# EAGLE design BNC CONECTOR (EAGLE 7.6.0)
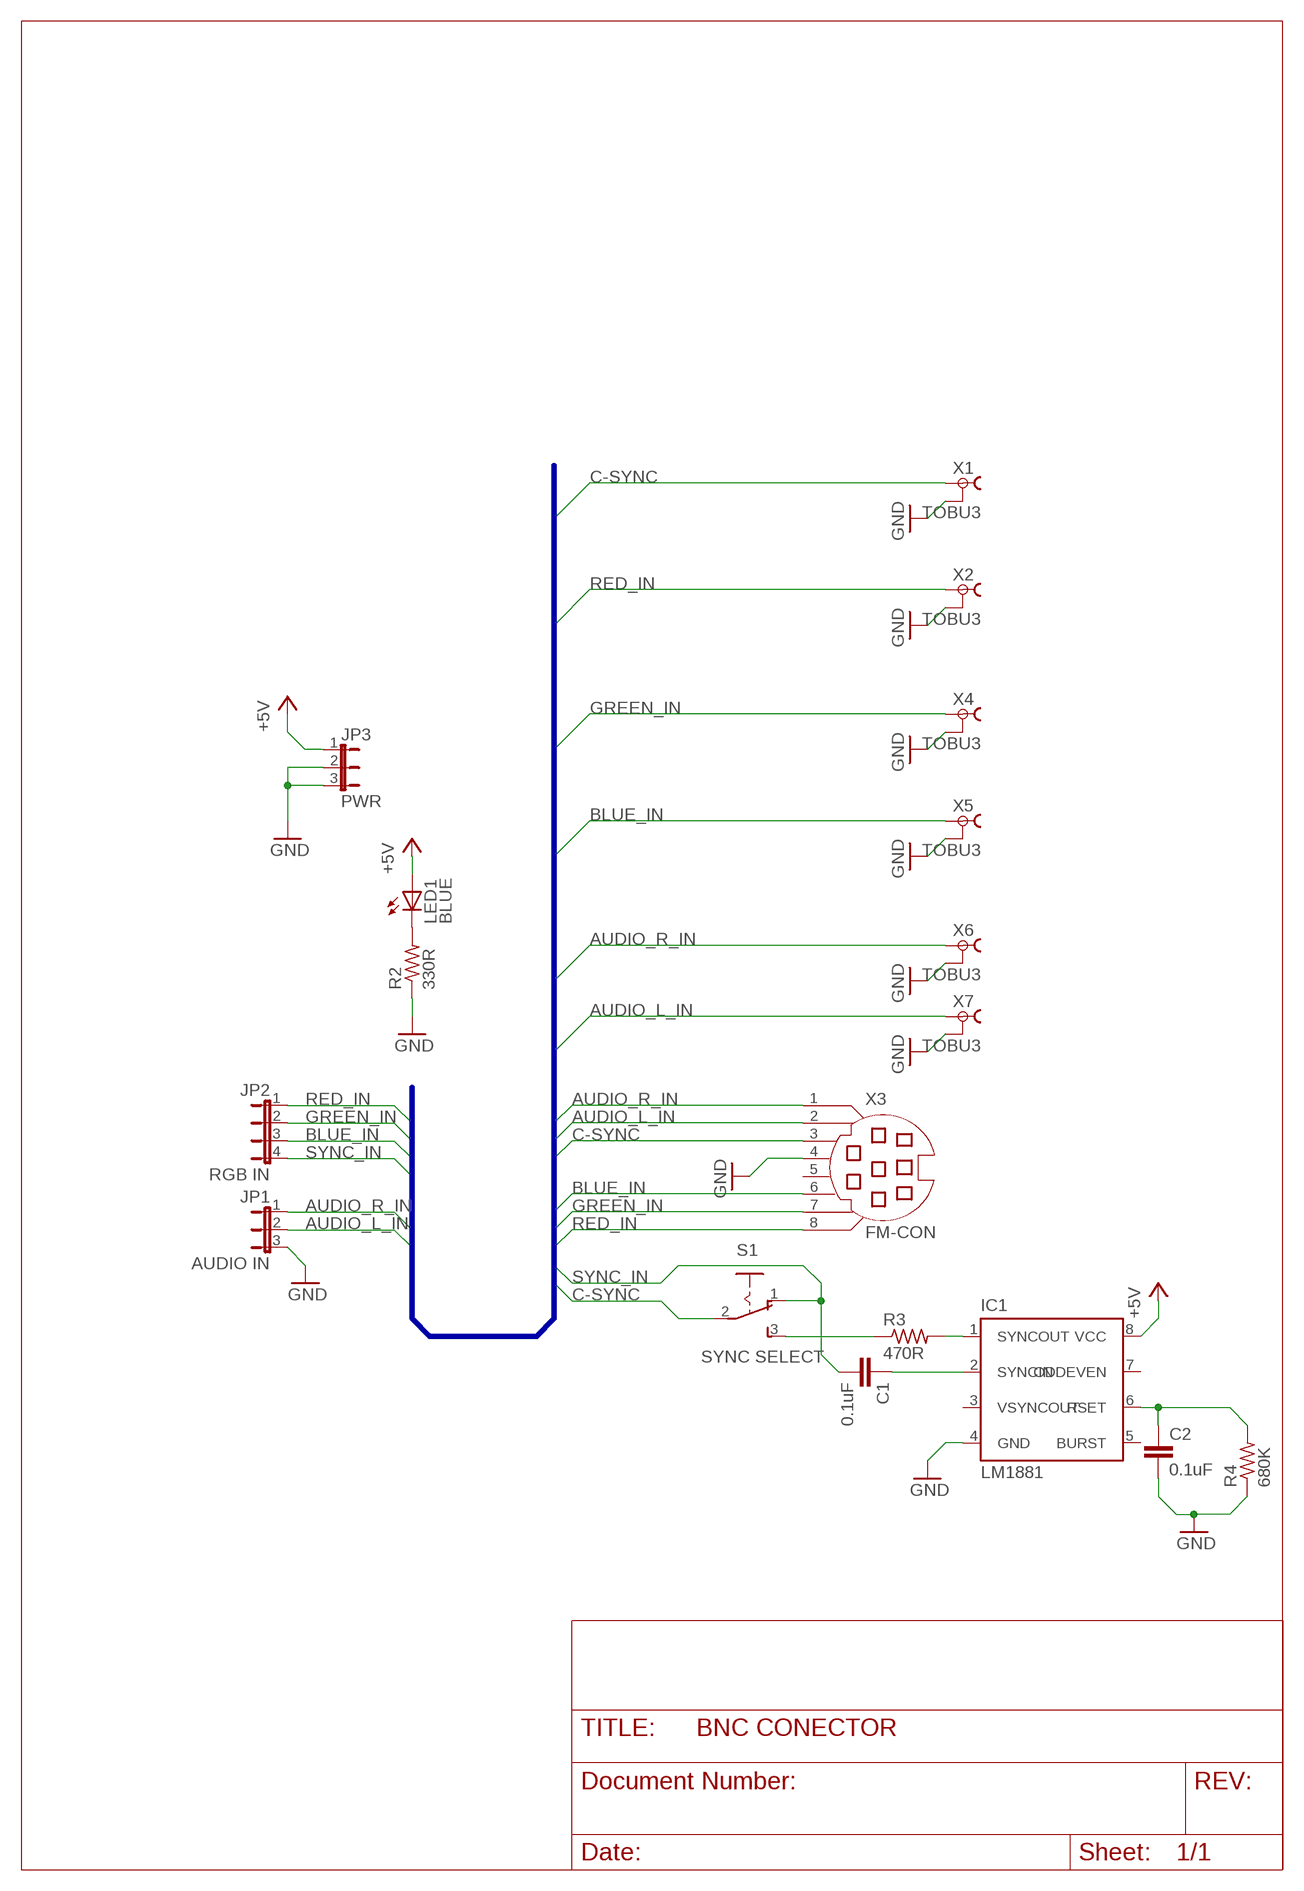
[diagram p0: schematic, sheet 1]

## Parts
C1  0.1uF  C7.5/3  [C7.5B3]
C2  0.1uF  C7.5/3  [C7.5B3]
IC1  LM1881  [DIL08]
JP1  AUDIO IN  JP2E  [JP2]
JP2  RGB IN  JP4E  [JP4]
JP3  PWR  JP2E  [JP2]
LED1  BLUE  LED5MM  [LED5MM]
R2  330R  R-US_0204/7  [0204/7]
R3  470R  R-US_0204/7  [0204/7]
R4  680K  R-US_0204/7  [0204/7]
S1  SYNC SELECT  255SB  [255SB]
X1  TOBU3  [TOBU3]
X2  TOBU3  [TOBU3]
X3  FM-CON  MD08SS  [MDIN08SS]
X4  TOBU3  [TOBU3]
X5  TOBU3  [TOBU3]
X6  TOBU3  [TOBU3]
X7  TOBU3  [TOBU3]

## Nets
+5V [SINGAL]: IC1.8(VCC) JP3.1 LED1.A
AUDIO_L_IN [SINGAL]: JP1.2 X3.2 X7.1
AUDIO_R_IN [SINGAL]: JP1.1 X3.1 X6.1
BLUE_IN [SINGAL]: JP2.3 X3.6 X5.1
C-SYNC [SINGAL]: S1.2(P) X1.1 X3.3
GND [SINGAL]: C2.2 IC1.4(GND) JP1.3 JP3.2 JP3.3 R2.1 R4.1 X1.2 X1.2@1 X1.2@2 X2.2 X2.2@1 X2.2@2 X3.4 X4.2 X4.2@1 X4.2@2 X5.2 X5.2@1 X5.2@2 X6.2 X6.2@1 X6.2@2 X7.2 X7.2@1 X7.2@2
GREEN_IN [SINGAL]: JP2.2 X3.7 X4.1
N$2 [SINGAL]: R3.1 S1.3(S)
N$3 [SINGAL]: IC1.1(SYNCOUT) R3.2
N$4: LED1.K(C) R2.2
N$5 [SINGAL]: C1.1 IC1.2(SYNCIN)
N$6 [SINGAL]: C2.1 IC1.6(RSET) R4.2
RED_IN [SINGAL]: JP2.1 X2.1 X3.8
SYNC_IN [SINGAL]: C1.2 JP2.4 S1.1(O)
Unconnected: IC1.3(VSYNCOUT) IC1.5(BURST) IC1.7(ODDEVEN) X3.5

## Buses
B$1

## Library data of the parts
C1 C2 = capacitor-wima:C: CAPACITOR naming: grid - package width
IC1 = lm1881:LM1881
JP1 JP3 = jumper:JP2E: JUMPER
JP2 = jumper:JP4E: JUMPER
LED1 = led:LED: LED OSRAM: - CHIPLED LG R971, LG N971, LY N971, LG Q971, LY Q971, LO R971, LY R971 LH N974, LH R974 LS Q976, LO Q976, LY Q976 LO Q996 - Hyper CHIPLED LW Q18S LB Q993, LB Q99A, LB R99A - SideLED LS A670, LO A670, LY A670, LG A670, LP A670 LB A673, LV A673, LT A673, LW A673 LH A674 LY A675 LS A676, LA A676, LO A676, LY A676, LW A676 LS A679, LY A679, LG A679 - Hyper Micro SIDELED® LS Y876, LA Y876, LO Y876, LY Y876 LT Y87S - SmartLED LW L88C, LW L88S LB L89C, LB L89S, LG L890 LS L89K, LO L89K, LY L89K LS L896, LA L896, LO L896, LY L896 - TOPLED LS T670, LO T670, LY T670, LG T670, LP T670 LSG T670, LSP T670, LSY T670, LOP T670, LYG T670 LG T671, LOG T671, LSG T671 LB T673, LV T673, LT T673, LW T673 LH T674 LS T676, LA T676, LO T676, LY T676, LB T676, LH T676, LSB T676, LW T676 LB T67C, LV T67C, LT T67C, LS T67K, LO T67K, LY T67K, LW E67C LS E67B, LA E67B, LO E67B, LY E67B, LB E67C, LV E67C, LT E67C LW T67C LS T679, LY T679, LG T679 LS T770, LO T770, LY T770, LG T770, LP T770 LB T773, LV T773, LT T773, LW T773 LH T774 LS E675, LA E675, LY E675, LS T675 LS T776, LA T776, LO T776, LY T776, LB T776 LHGB T686 LT T68C, LB T68C - Hyper Mini TOPLED® LB M676 - Mini TOPLED Santana® LG M470 LS M47K, LO M47K, LY M47K Source: http://www.osram.convergy.de LUXEON: - LUMILED® LXK2-PW12-R00, LXK2-PW12-S00, LXK2-PW14-U00, LXK2-PW14-V00 LXK2-PM12-R00, LXK2-PM12-S00, LXK2-PM14-U00 LXK2-PE12-Q00, LXK2-PE12-R00, LXK2-PE12-S00, LXK2-PE14-T00, LXK2-PE14-U00 LXK2-PB12-K00, LXK2-PB12-L00, LXK2-PB12-M00, LXK2-PB14-N00, LXK2-PB14-P00, LXK2-PB14-Q00 LXK2-PR12-L00, LXK2-PR12-M00, LXK2-PR14-Q00, LXK2-PR14-R00 LXK2-PD12-Q00, LXK2-PD12-R00, LXK2-PD12-S00 LXK2-PH12-R00, LXK2-PH12-S00 LXK2-PL12-P00, LXK2-PL12-Q00, LXK2-PL12-R00 Source: www.luxeon.com KINGBRIGHT: KA-3528ASYC Source: www.kingbright.com
R2-R4 = rcl:R-US_: RESISTOR, American symbol
S1 = switch:255SB: SLIDING SWITCH Distributor Buerklin, 11G810
X1 X2 X4-X7 = con-hirschmann:TOBU3: Female Cinch CONNECTOR ( RCA Jack ); MF: FARNELL; MPN: TOBU 3; OC_FARNELL: 592791; OC_NEWARK: 06WX5914
X3 = con-yamaichi:MD08SS: YAMAICHI CONNECTOR; OC_FARNELL: unknown; OC_NEWARK: unknown

## Net classes
1 SINGAL: width 0.5 mm

## Board
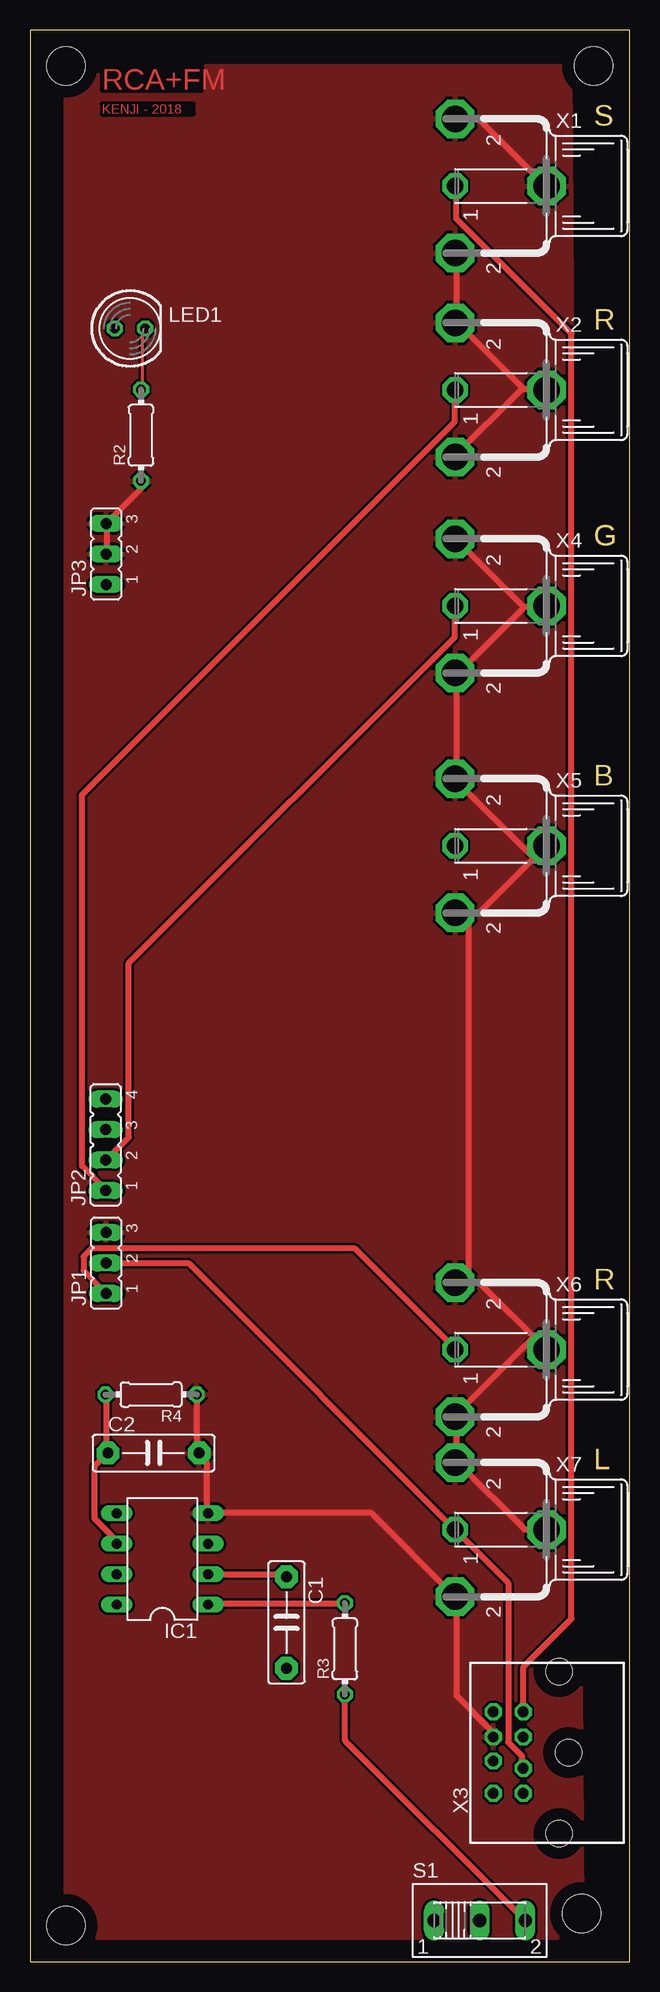
[diagram p1: board, top side]
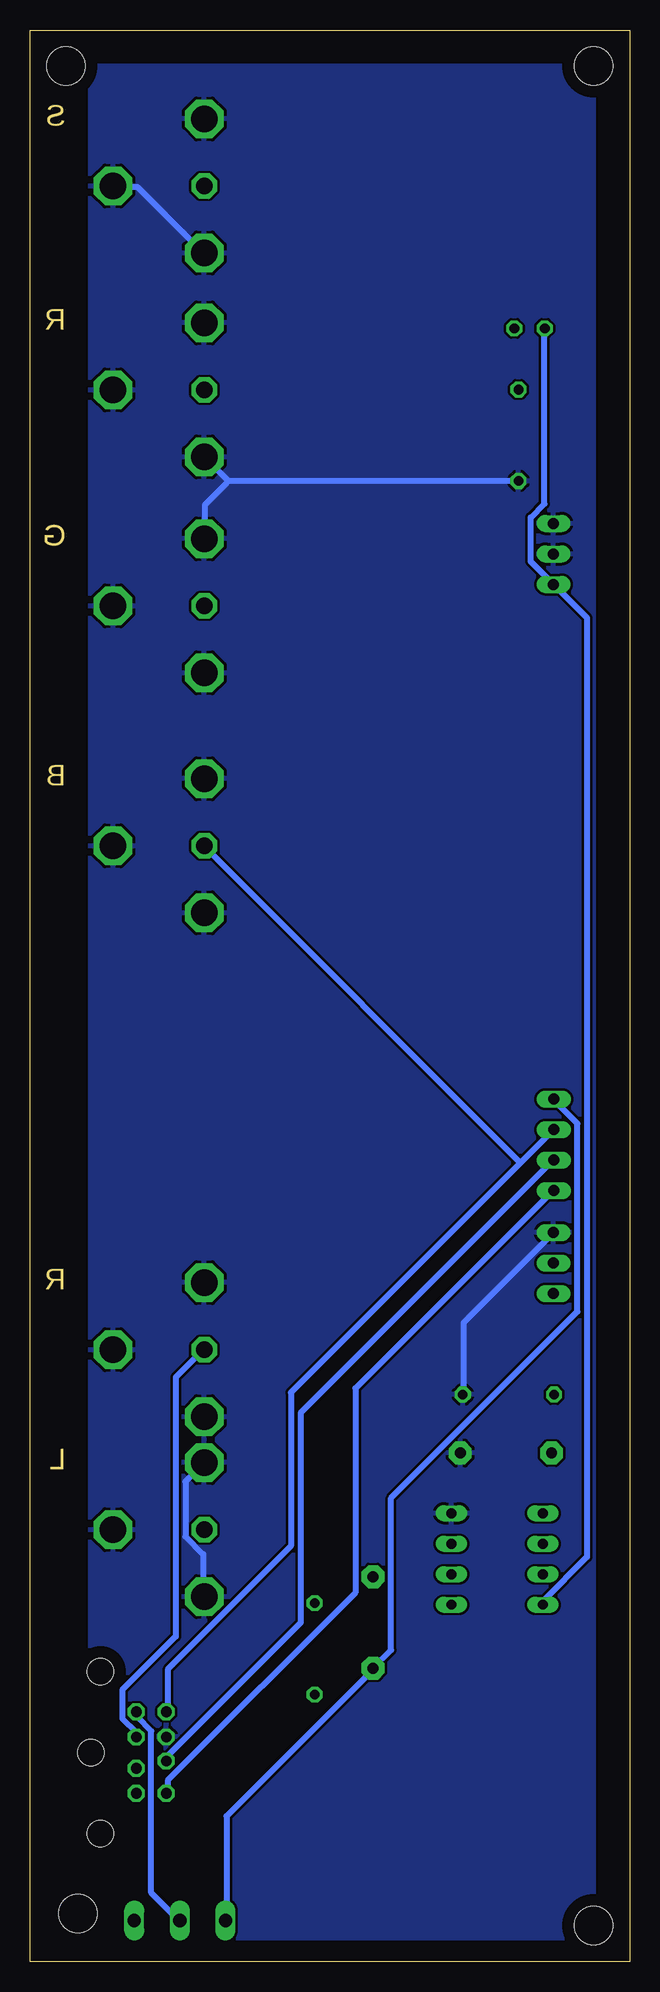
[diagram p2: board, bottom side, seen from below]

Size 50 x 161 mm. Coordinates in mm from the lower left corner, seen from the top.
Outline: 0,0 50,0 50,161 0,161 0,0
Copper layers (1*16): Top 0.035mm / dielectric 1.5mm / Bottom 0.035mm
Design rules "default": minimum track width 10mil, minimum drill 24mil, track to track 8mil, track to pad 8mil, pad to pad 8mil, via to via 8mil, smd to smd 8mil, copper to edge 40mil, drill to drill 8mil, minimum pad ring 10mil, minimum via ring 8mil, stop-mask expansion 4mil, vias tented up to drill 0mil, thermal gap 10mil
Holes 3.2 mm at 47,158 46,4 3,158 3,3

### Footprints (pad centres in the part's own frame; a part is rotated, then mirrored left to right if it is on the bottom)
C7.5B3 = drill 0.914 pad 1.905 octagon: 1 -3.81,0; 2 3.81,0
DIL08 = drill 0.813 long: 1 -3.81,-3.81; 2 -1.27,-3.81; 3 1.27,-3.81; 4 3.81,-3.81; 5 3.81,3.81; 6 1.27,3.81; 7 -1.27,3.81; 8 -3.81,3.81
JP2 = drill 0.914 long: 1 -2.54,0; 2 0,0; 3 2.54,0
JP4 = drill 0.914 long: 1 -3.81,0; 2 -1.27,0; 3 1.27,0; 4 3.81,0
LED5MM = drill 0.813 octagon: A -1.27,0; K 1.27,0
0204/7 = drill 0.813 octagon: 1 -3.81,0; 2 3.81,0
255SB = drill 1.118 long: 1 -3.81,0; 2 0,0; 3 3.81,0
TOBU3 = drill 1.397 octagon: 1 0,-2.54 | drill 2.21 octagon: 2 5.588,-2.54; 2@1 -5.588,-2.54; 2@2 0,5.08
MDIN08SS = drill 0.9 octagon: 1 1.3,8.5; 2 -1.3,8.5; 3 3.4,8.5; 4 1.3,11; 5 -3.4,8.5; 6 3.4,11; 7 -0.7,11; 8 -3.4,11 | hole 2.2: -6.75,5.5; 0,4.7; 6.75,5.5

### Placement (x,y rotation side)
C1  21.39,28.26 270 top
C2  10.31,42.39 0 top
IC1  11.04,33.55 90 top
JP1  6.34,58.22 90 top
JP2  6.31,68.07 90 top
JP3  6.34,117.33 90 top
LED1  8.34,136.12 0 top
R2  9.26,127.22 90 top
R3  26.26,26.06 90 top
R4  10.1,47.26 180 top
S1  37.5,3.42 0 top
X1  38,148 270 top
X2  38,131 270 top
X3  49.63,17.41 90 top
X4  38,113 270 top
X5  38,93 270 top
X6  38,51 270 top
X7  38,36 270 top

### Tracks (layer width: path | path; a pad name or v marks a point on that pad's centre or on a via)
+5V
  Bottom 0.5: LED1.A 7.09,136.02 7.09,121.5 8.23,120.36 8.23,116.7 6.4,114.87 JP3.1 6.17,114.64 3.54,112.01 3.54,33.72 7.2,30.06 7.2,29.83 IC1.8
AUDIO_L_IN
  Top 0.5: X3.2 41.03,16.12 41.03,17.14 39.89,18.29 39.89,31.55 35.55,35.89 X7.1 35.32,36.12 13.26,58.18 6.4,58.18 JP1.2
AUDIO_R_IN
  Top 0.5: JP1.1 6.29,55.78 4.46,57.61 4.46,58.75 5.14,59.44 27.09,59.44 35.43,51.09 X6.1
  Bottom 0.5: X3.1 41.15,18.75 41.15,19.09 42.29,20.23 42.29,22.63 37.83,27.09 37.83,48.69 35.55,50.98 X6.1
BLUE_IN
  Bottom 0.5: 9.09,66.58 6.4,69.27 JP2.3 | 9.09,66.58 28.23,47.43 28.23,34.63 38.52,24.35 38.52,20.92 X3.6 | 9.09,66.58 35.43,92.93 X5.1
C-SYNC
  Top 0.5: X1.1 35.55,147.9 35.55,145.28 45.15,135.67 45.15,28.57 41.15,24.57 41.15,20.92 X3.3
  Bottom 0.5: X3.3 41.03,20.8 41.03,20.34 39.89,19.2 39.89,5.71 37.61,3.43 S1.2
GND
  Top 0.5: R4.1 13.95,47.21 13.95,42.52 14.06,42.41 C2.2 14.17,42.18 14.75,41.6 14.75,37.38 IC1.4 15.09,37.38 28.46,37.38 35.32,30.52 X7.2 35.55,30.4 35.55,22.17 38.52,19.2 38.52,18.75 X3.4 | X7.2@2 42.98,36.01 41.26,36.01 35.78,41.49 X7.2@1 35.55,41.6 35.55,45.38 X6.2 35.55,45.61 41.84,51.89 X6.2@2 42.98,51.09 37.49,56.58 35.55,56.58 X6.2@1 36.58,56.81 36.58,87.21 X5.2 35.55,87.44 37.49,87.44 42.98,92.93 X5.2@2 41.84,92.13 35.55,98.41 X5.2@1 35.55,98.64 35.55,107.33 X4.2 35.78,107.44 41.26,112.93 | 41.26,112.93 42.98,112.93 X4.2@2 | X1.2@1 35.55,153.5 37.49,153.5 42.98,148.02 X1.2@2 | X1.2 35.55,142.3 35.55,136.59 X2.2@1 35.78,136.47 41.15,131.1 | 41.15,131.1 42.98,131.1 X2.2@2 | R2.1 9.26,123.33 9.26,122.76 6.4,119.9 JP3.3 6.4,119.67 6.4,117.39 JP3.2 | 41.15,131.1 40.92,130.99 35.43,125.5 X2.2 | 41.26,112.93 41.03,113.04 35.55,118.53 X4.2@1
  Bottom 0.5: JP1.3 6.4,60.69 13.83,53.26 13.83,47.32 R4.1 | X7.2 35.55,30.52 35.55,33.95 37.03,35.43 37.03,40.01 35.55,41.49 X7.2@1 | X1.2@2 42.98,147.9 41.03,147.9 35.55,142.42 X1.2 | 33.49,123.44 9.37,123.44 R2.1 | 33.49,123.44 35.43,125.39 X2.2 | X4.2@1 35.43,118.64 35.43,121.39 33.6,123.22 33.49,123.44
  pour Top: 3,158 45,158 46,4 44,2 4,2 3,3
  pour Bottom: 3,158 45,158 45,3 44,2 4,2 3,3
GREEN_IN
  Top 0.5: X4.1 35.43,112.93 35.43,110.41 8.23,83.21 8.23,68.69 6.4,66.86 JP2.2
  Bottom 0.5: X3.7 38.52,16.8 38.52,17.14 27.43,28.23 27.43,45.72 6.4,66.75 JP2.2
N$2
  Top 0.5: R3.1 26.29,22.17 26.29,18.4 41.26,3.43 S1.3
N$3
  Top 0.5: IC1.1 14.86,29.83 26.18,29.83 R3.2
N$4
  Top 0.254: R2.2 9.37,131.1 9.37,135.79 9.6,136.02 LED1.K
N$5
  Top 0.5: IC1.2 14.86,32.23 21.26,32.23 21.38,32.12 C1.1
N$6
  Top 0.5: R4.2 6.4,47.21 6.4,42.41 C2.1 6.29,42.18 5.37,41.26 5.37,36.92 7.2,35.09 7.2,34.86 IC1.6
RED_IN
  Top 0.5: X2.1 35.43,130.99 35.43,128.36 4.34,97.27 4.34,66.29 6.29,64.35 JP2.1
  Bottom 0.5: X3.8 38.52,14.06 38.52,15.09 22.86,30.75 22.86,47.78 6.4,64.24 JP2.1
SYNC_IN
  Bottom 0.5: JP2.4 6.29,71.78 4.34,69.84 4.34,54.18 19.89,38.63 19.89,25.95 21.38,24.46 C1.2 21.49,24.23 33.6,12.12 33.6,3.43 S1.1

### Text on the board
Top: RCA+FM | KENJI - 2018
Dimension: S | R | G | B | R | L